# Altium schematic sheet PSU_MAX1831_1V2.SchDoc: PSU MAX1831 1V2
size A4; Organization: Altium Limited.; Address1: Level 3, 12a Rodborough Rd; Address2: Frenchs Forest 2086; Address3: NSW; Address4: AUSTRALIA; Revision: 6; SheetNumber: 37; SheetTotal: 64
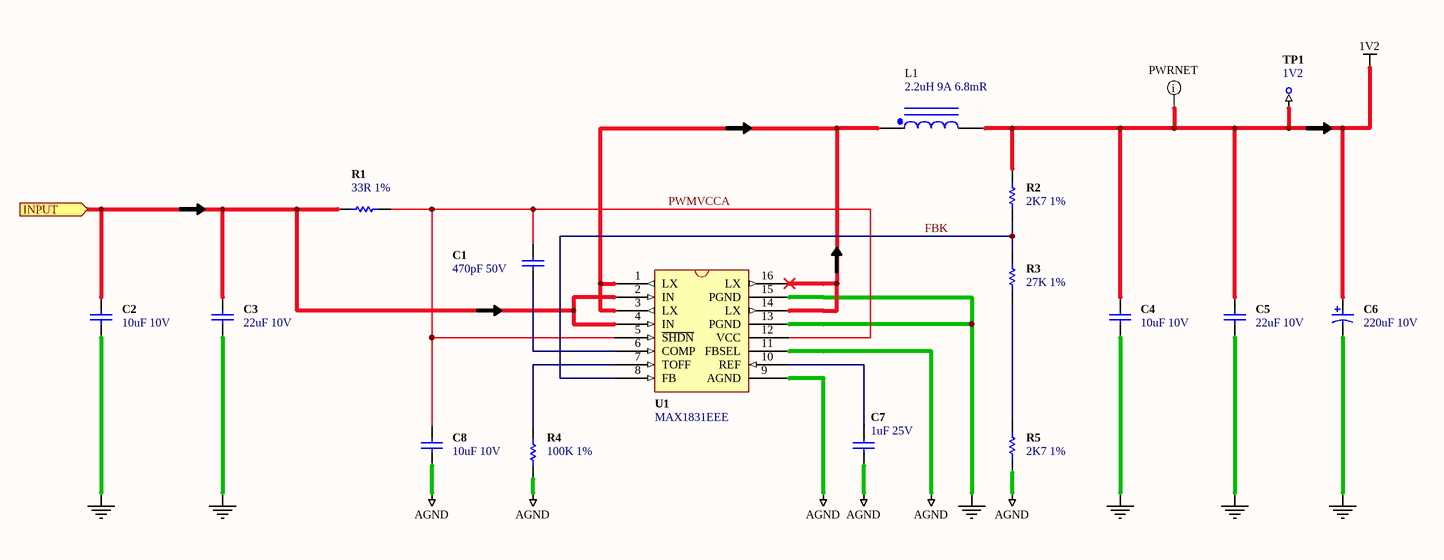
[diagram p0: PSU_MAX1831_1V2.SchDoc]

## Parts
C1  470pF 50V  [CAPC1005-STAR]
C2  10uF 10V  [CAPC2012-STAR]
C3  22uF 10V  [CAPC3225-STAR]
C4  10uF 10V  [CAPC2012-STAR]
C5  22uF 10V  [CAPC3225-STAR]
C6  220uF 10V  [CAPC7343-STAR]
C7  1uF 25V  [CAPC3216-STAR]
C8  10uF 10V  [CAPC2012-STAR]
L1  2.2uH 9A 6.8mR  [INDP182140]
R1  33R 1%  [RESC1005-STAR]
R2  2K7 1%  [RESC1005-STAR]
R3  27K 1%  [RESC1005-STAR]
R4  100K 1%  [RESC1005-STAR]
R5  2K7 1%  [RESC1005-STAR]
TP1  1V2  [TestPin]  (no BOM)
U1  MAX1831EEE  [SOP63P602-16]

## Ports
INPUT (in)

## Nets
1V2: C4.2 C5.2 C6.1 L1.2 R2.2 TP1.1
AGND: C7.2 C8.1 R4.1 R5.1 U1.9(AGND) U1.11(FBSEL)
GND: C2.1 C3.1 C4.1 C5.1 C6.2 U1.13(PGND) U1.15(PGND)
FBK: R2.1 R3.2 U1.8(FB)
INPUT: C2.2 C3.2 R1.2 U1.2(IN) U1.4(IN) ; port INPUT
PWMVCCA: C1.1 C8.2 R1.1 U1.5(~{SHDN}) U1.12(VCC)
NetC1_2: C1.2 U1.6(COMP)
NetC7_1: C7.1 U1.10(REF)
NetL1_1: L1.1 U1.1(LX) U1.3(LX) U1.14(LX) U1.16(LX)
NetR3_1: R3.1 R5.2
NetR4_2: R4.2 U1.7(TOFF)

## Layout directives
net class PWRNET: 1V2

## Notes on the sheet
- Sheet Title
- Project Title
- Size:
- Date:
- A4
- Assy:
- Time:
- Sheet
- Revision:
- of
- File:

## Library data of the parts
C1 = D-101-0069: Capacitor, Ceramic, 470pF 5% 50V 0402 (1005) COG; Polarity: Non-Polarized; ClassName: COMP_1V2; Category: Capacitor; Capacitance: 470 pF; Dielectric: COG; Mounting Technology: Surface Mount; Rated Voltage: 50 V; Status: Production; Technology: Ceramic; Tolerance: 5 %
C2 C4 C8 = D-101-0087: Capacitor, Ceramic, 10uF 10% 10V 0805 (2012) X5R; Polarity: Non-Polarized; Category: Capacitor; Capacitance: 10 uF; Dielectric: X5R; Mounting Technology: Surface Mount; Rated Voltage: 10 V; Status: Unreleased; Technology: None; Tolerance: 10 %
C3 C5 = D-101-0021: Capacitor, Ceramic, 22uF -20%/+80% 10V 1210 (3225) Y5V; Polarity: Non-Polarized; Tolerance: -20 / +80 %; Category: Capacitor; Capacitance: 22 uF; Dielectric: Y5V; Mounting Technology: Surface Mount; Rated Voltage: 10 V; Status: Production; Technology: Ceramic
C6 = D-101-0088: Capacitor, Tantalum, 220uF 10% 10V MCCT-D (7343-31); Polarity: Polarized; Category: Capacitor; Capacitance: 220 uF; Mounting Technology: Surface Mount; Rated Voltage: 10 V; Status: Unreleased; Technology: Tantalum; Tolerance: 10 %
C7 = D-101-0027: Capacitor, Ceramic, 1uF 10% 25V 1206 (3216) X7R; Polarity: Non-Polarized; Category: Capacitor; Capacitance: 1 uF; Dielectric: X7R; Mounting Technology: Surface Mount; Rated Voltage: 25 V; Status: Production; Technology: Ceramic; Tolerance: 10 %
L1 = D-102-0000: Inductor, 2.2uH 9A 6.8mR 20% INDP182140 SB18062R2MSB; Category: Inductor; Inductance: 2.2 uH; Max Input Current: 9 A; Mounting Technology: Surface Mount; Status: Production
R1 = D-100-0102: Resistor, 33R 1% 0402 (1005); Power Rating: 63 mW; Category: Resistor; Mounting Technology: Surface Mount; Resistance: 33 R; Status: Production; Tolerance: 1 %
R2 R5 = D-100-0105: Resistor, 2K7 1% 0402 (1005); Power Rating: 63 mW; Resistance: 2.7 K; Category: Resistor; Mounting Technology: Surface Mount; Status: Production; Tolerance: 1 %
R3 = D-100-0109: Resistor, 27K 1% 0402 (1005); Power Rating: 63 mW; Category: Resistor; Mounting Technology: Surface Mount; Resistance: 27 K; Status: Production; Tolerance: 1 %
R4 = D-100-0132: Resistor, 100K 1% 0402 (1005); Power Rating: 63 mW; Category: Resistor; Mounting Technology: Surface Mount; Resistance: 100 K; Status: Production; Tolerance: 1 %
TP1 = D-006-0000: Test Point, PCB Mount with Silkscreen Box; Category: Test-Point; Status: Production
U1 = D-204-0002: MAX1831EEE, 3A, 1MHz, Low-Voltage, Step-Down Regulators with Synchronous Rectification and Internal Switches; Max Input Voltage: 5.5 V; Max Output Voltage: 5.5 mV; Min Input Voltage: 3 V; Min Output Voltage: 1.084 V; Supply Voltage: mV; Category: IC-Power; Max Output Current: 3 A; Mounting Technology: Surface Mount; Status: Production; Temperature Range: -40 to +85 deg C